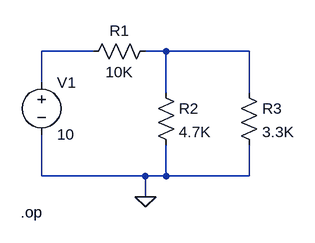
[diagram p0: schematic simulacion.asc]
simulacion.asc, the LTspice schematic file:
Version 4.1
SHEET 1 880 680
WIRE 112 112 32 112
WIRE 224 112 192 112
WIRE 352 112 224 112
WIRE 32 160 32 112
WIRE 224 176 224 112
WIRE 352 176 352 112
WIRE 32 304 32 240
WIRE 192 304 32 304
WIRE 224 304 224 256
WIRE 224 304 192 304
WIRE 352 304 352 256
WIRE 352 304 224 304
WIRE 192 336 192 304
FLAG 192 336 0
SYMBOL res 208 96 R90
WINDOW 0 0 56 VBottom 2
WINDOW 3 32 56 VTop 2
SYMATTR InstName R1
SYMATTR Value 10K
SYMBOL res 208 160 R0
SYMATTR InstName R2
SYMATTR Value 4.7K
SYMBOL res 336 160 R0
SYMATTR InstName R3
SYMATTR Value 3.3K
SYMBOL voltage 32 144 R0
SYMATTR InstName V1
SYMATTR Value 10
TEXT 0 360 Left 2 !.op

The netlist it stands for:
* simulacion.asc
R1 N002 N001 10K
R2 N002 0 4.7K
R3 N002 0 3.3K
V1 N001 0 10
.op
.backanno
.end